# EAGLE design ioio-arduino-shield (EAGLE 6.1)
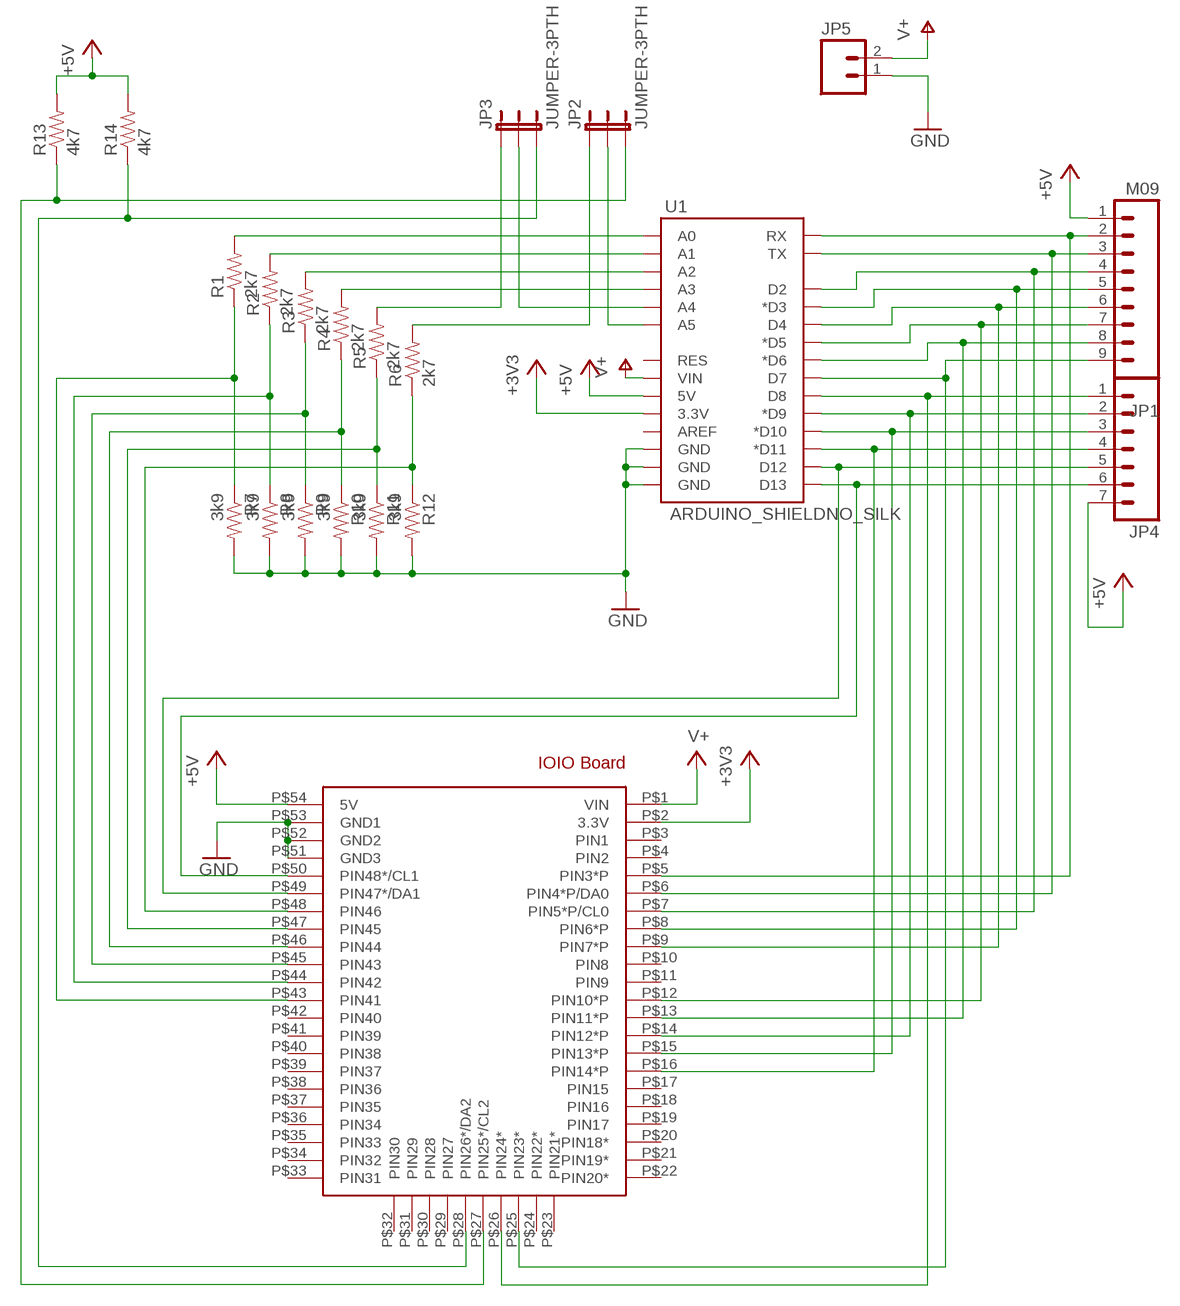
[diagram p0: schematic, sheet 1]

## Parts
JP1  M09  [1X09]
JP2  JUMPER-3PTH  [1X03]
JP3  JUMPER-3PTH  [1X03]
JP4  M07  [1X07]
JP5  M025MM  [SCREWTERMINAL-5MM-2]
R1  2k7  RESISTOR0805-RES  [0805]
R2  2k7  RESISTOR0805-RES  [0805]
R3  2k7  RESISTOR0805-RES  [0805]
R4  2k7  RESISTOR0805-RES  [0805]
R5  2k7  RESISTOR0805-RES  [0805]
R6  2k7  RESISTOR0805-RES  [0805]
R7  3k9  RESISTOR0805-RES  [0805]
R8  3k9  RESISTOR0805-RES  [0805]
R9  3k9  RESISTOR0805-RES  [0805]
R10  3k9  RESISTOR0805-RES  [0805]
R11  3k9  RESISTOR0805-RES  [0805]
R12  3k9  RESISTOR0805-RES  [0805]
R13  4k7  RESISTOR0805-RES  [0805]
R14  4k7  RESISTOR0805-RES  [0805]
U1  ARDUINO_SHIELDNO_SILK  [DUEMILANOVE_VIAS]
U$1  IOIO  [IOIO]

## Nets
+3V3: U1.3.3V U$1.P$2(3.3V)
+5V: JP1.1 JP4.7 R13.2 R14.2 U1.5V U$1.P$54(5V)
GND: JP5.1 R7.2 R8.2 R9.2 R10.2 R11.2 R12.2 U1.GND@0(GND) U1.GND@1(GND) U1.GND@2(GND) U$1.P$51(GND3) U$1.P$52(GND2) U$1.P$53(GND1)
N$1: R1.2 U1.A0
N$2: R2.2 U1.A1
N$3: R3.2 U1.A2
N$4: R4.2 U1.A3
N$5: JP3.1 R5.2
N$6: JP3.2 U1.A4
N$7: JP2.1 R6.2
N$8: JP2.2 U1.A5
N$9: R1.1 R7.1 U$1.P$43(PIN41)
N$10: JP1.2 U1.RX U$1.P$5(PIN3*P)
N$11: JP1.3 U1.TX U$1.P$6(PIN4*P/DA0)
N$13: JP1.4 U1.D2 U$1.P$7(PIN5*P/CL0)
N$14: JP1.5 U1.D3(*D3) U$1.P$8(PIN6*P)
N$15: U1.D4 U$1.P$9(PIN7*P)
N$16: JP1.7 U1.D5(*D5) U$1.P$12(PIN10*P)
N$17: JP1.8 U1.D6(*D6) U$1.P$13(PIN11*P)
N$18: JP4.1 U1.D8 U$1.P$26(PIN24*)
N$19: JP4.2 U1.D9(*D9) U$1.P$14(PIN12*P)
N$20: JP4.3 U1.D10(*D10) U$1.P$15(PIN13*P)
N$21: JP4.4 U1.D11(*D11) U$1.P$16(PIN14*P)
N$22: JP4.5 U1.D12 U$1.P$49(PIN47*/DA1)
N$23: JP4.6 U1.D13 U$1.P$50(PIN48*/CL1)
N$24: R2.1 R8.1 U$1.P$44(PIN42)
N$25: R3.1 R9.1 U$1.P$45(PIN43)
N$26: R4.1 R10.1 U$1.P$46(PIN44)
N$27: R5.1 R11.1 U$1.P$47(PIN45)
N$29: R6.1 R12.1 U$1.P$48(PIN46)
N$30: U1.D7 U$1.P$25(PIN23*)
N$31: JP2.3 R13.1 U$1.P$27(PIN25*/CL2)
N$32: JP3.3 R14.1 U$1.P$28(PIN26*/DA2)
V+: JP5.2 U1.VIN U$1.P$1(VIN)
Unconnected: JP1.6 JP1.9 U1.AREF U1.RES U$1.P$3(PIN1) U$1.P$4(PIN2) U$1.P$10(PIN8) U$1.P$11(PIN9) U$1.P$17(PIN15) U$1.P$18(PIN16) U$1.P$19(PIN17) U$1.P$20(PIN18*) U$1.P$21(PIN19*) U$1.P$22(PIN20*) U$1.P$23(PIN21*) U$1.P$24(PIN22*) U$1.P$29(PIN27) U$1.P$30(PIN28) U$1.P$31(PIN29) U$1.P$32(PIN30) U$1.P$33(PIN31) U$1.P$34(PIN32) U$1.P$35(PIN33) U$1.P$36(PIN34) U$1.P$37(PIN35) U$1.P$38(PIN36) U$1.P$39(PIN37) U$1.P$40(PIN38) U$1.P$41(PIN39) U$1.P$42(PIN40)

## Library data of the parts
JP1 = SparkFun-Connectors:M09: Header 9 Standard 9-pin 0.1" header. Use with straight break away headers (SKU : PRT-00116), right angle break away headers (PRT-00553), swiss pins (PRT-00743), machine pins (PRT-00117), and female headers (PRT-00115).
JP2 JP3 = SparkFun-Passives:JUMPER-3
JP4 = SparkFun-Connectors:M07: Header 7 Standard 7-pin 0.1" header. Use with straight break away headers (SKU : PRT-00116), right angle break away headers (PRT-00553), swiss pins (PRT-00743), machine pins (PRT-00117), and female headers (PRT-00115). NOTES ON THE VARIANTS LOCK and LOCK_LONGPADS... This footprint was designed to help hold the alignment of a through-hole component (i.e. 7-pin header) while soldering it into place. You may notice that each hole has been shifted either up or down by 0.005 of an inch from it's more standard position (which is usually a perfectly straight line). This slight alteration caused the pins (the squares in the middle) to touch the edges of the holes. Because they are alternating, it causes a "brace" to hold the header in place. 0.005 has proven to be the perfect amount of "off-center" position when using our standard breakaway headers. Although looks a little odd when you look at the bare footprint, once you have a header in there, the alteration is very hard to notice. Also, if you push a header all the way into place, it is covered up entirely on the bottom side. This idea of altering the position of holes to aid alignment will be further integrated into the Sparkfun Library for other footprints. It can help hold any component with 3 or more connection pins.
JP5 = SparkFun-Connectors:M02: Header 2 Standard 2-pin 0.1" header. Use with straight break away headers (SKU : PRT-00116), right angle break away headers (PRT-00553), swiss pins (PRT-00743), machine pins (PRT-00117), and female headers (PRT-00115). Molex polarized connector foot print use with SKU : PRT-08233 with associated crimp pins and housings.
R1-R14 = SparkFun-Passives:RESISTOR: Resistor Basic schematic elements and footprints for 0603, 1206, and PTH resistors.
U1 = SparkFun-Boards:ARDUINO_SHIELD: Arduino shield footprint
U$1 = SparkFun-IOIO:IOIO

## Board
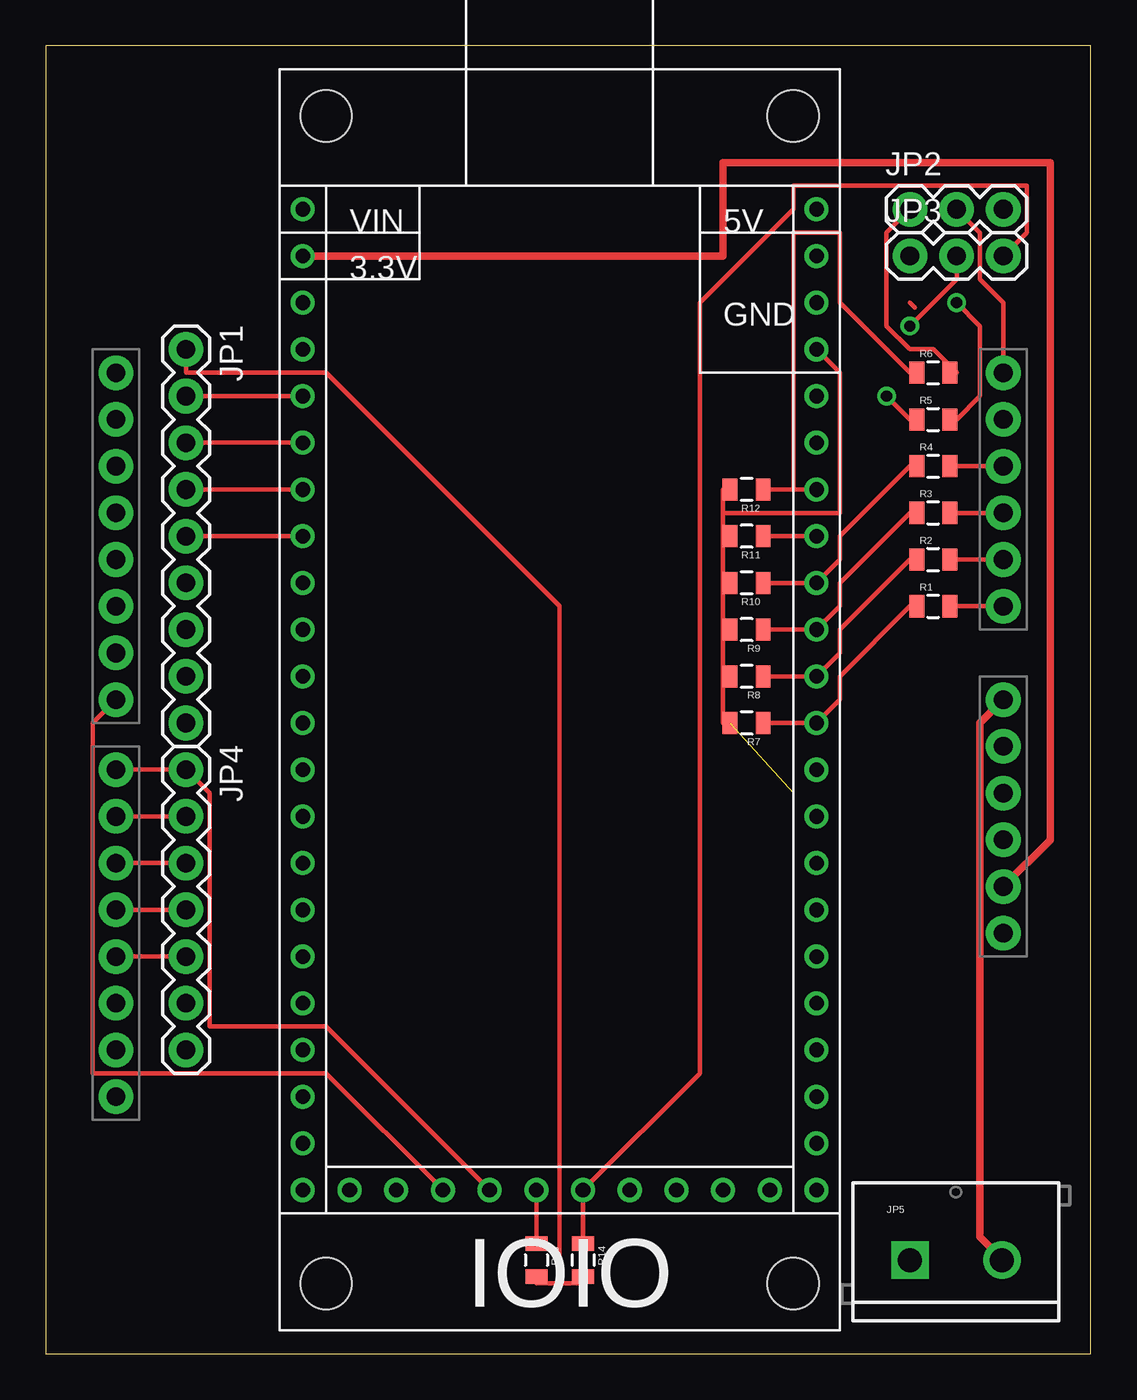
[diagram p1: board, top side]
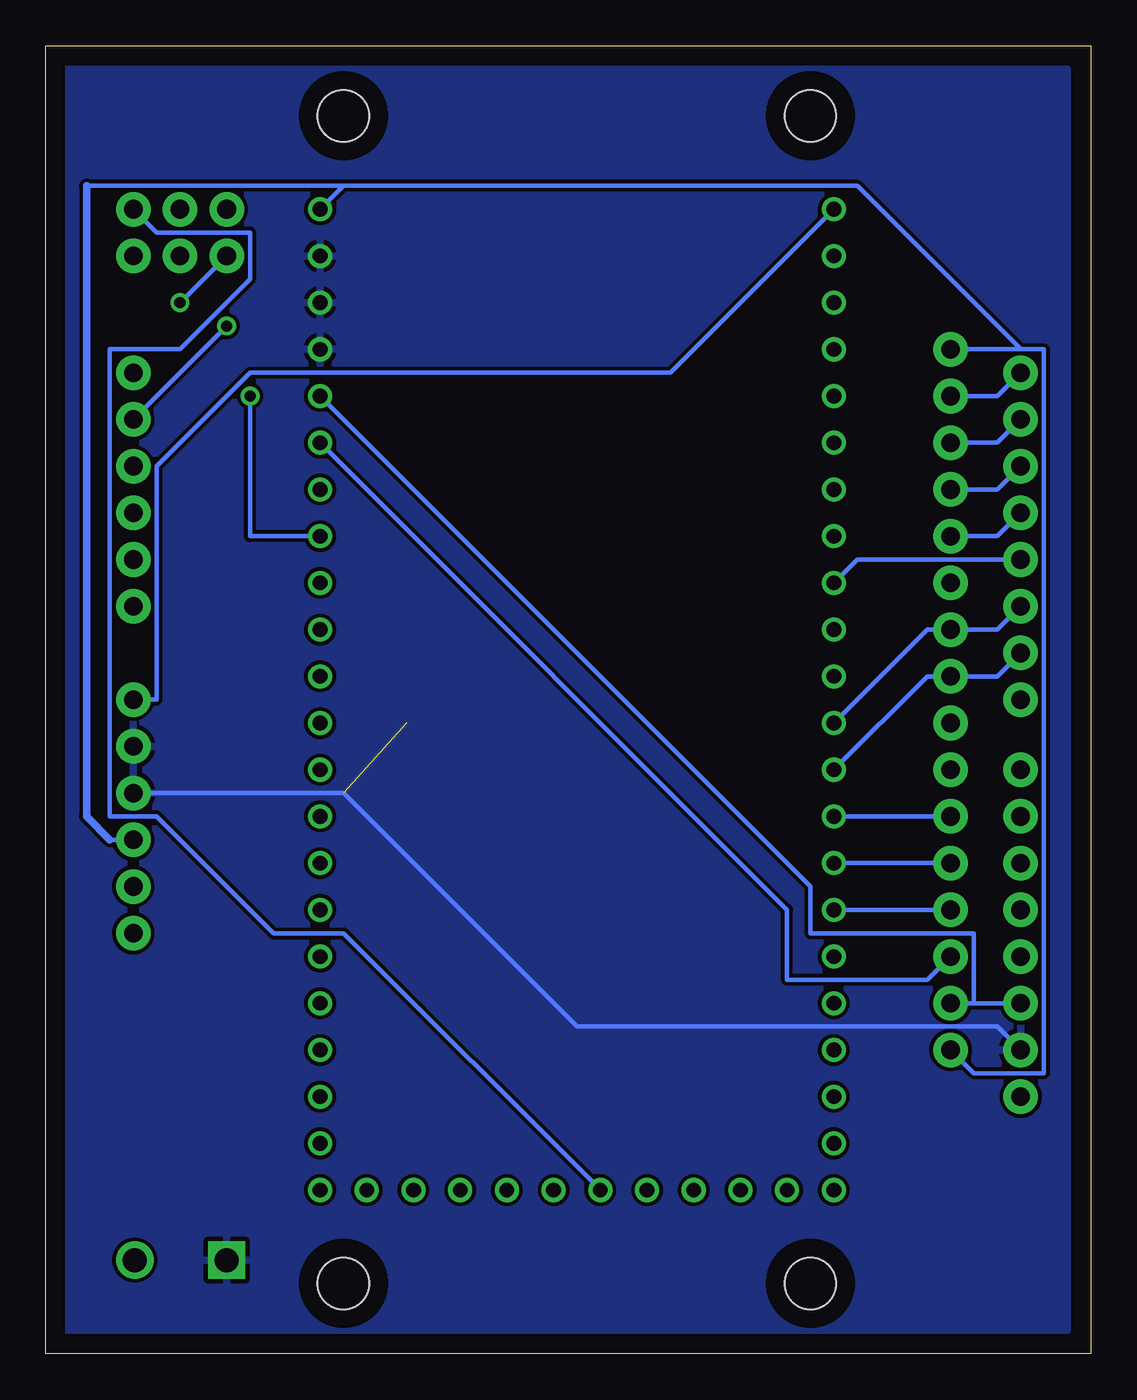
[diagram p2: board, bottom side, seen from below]

Size 56.82 x 71.11 mm. Coordinates in mm from the lower left corner, seen from the top.
Outline: 0,0 56.82,0 56.82,71.11 0,71.11 0,0
Copper layers (1*16): Top 0.035mm / dielectric 1.5mm / Bottom 0.035mm
Design rules: minimum track width 10mil, minimum drill 24mil, track to track 8mil, track to pad 8mil, pad to pad 8mil, via to via 8mil, smd to smd 8mil, copper to edge 40mil, drill to drill 8mil, minimum pad ring 10mil, minimum via ring 8mil, stop-mask expansion 4mil, vias tented up to drill 0mil, thermal gap 10mil

### Footprints (pad centres in the part's own frame; a part is rotated, then mirrored left to right if it is on the bottom)
1X09 = drill 1.016 pad 1.88: 1 0,0; 2 2.54,0; 3 5.08,0; 4 7.62,0; 5 10.16,0; 6 12.7,0; 7 15.24,0; 8 17.78,0; 9 20.32,0
1X03 = drill 1.016 pad 1.88: 1 0,0; 2 2.54,0; 3 5.08,0
1X07 = drill 1.016 pad 1.88: 1 0,0; 2 2.54,0; 3 5.08,0; 4 7.62,0; 5 10.16,0; 6 12.7,0; 7 15.24,0
SCREWTERMINAL-5MM-2 = drill 1.3 pad 2.032 square: 1 0,0 | drill 1.3 pad 2.032: 2 5,0
0805 = smd 0.8 x 1.2: 1 -0.9,0; 2 0.9,0
DUEMILANOVE_VIAS = drill 1.016 pad 1.88: 3.3V 50.8,13.97; 5V 50.8,16.51; A0 50.8,29.21; A1 50.8,31.75; A2 50.8,34.29; A3 50.8,36.83; A4 50.8,39.37; A5 50.8,41.91; AREF 2.54,2.54; D2 2.54,36.83; D3 2.54,34.29; D4 2.54,31.75; D5 2.54,29.21; D6 2.54,26.67; D7 2.54,24.13; D8 2.54,20.32; D9 2.54,17.78; D10 2.54,15.24; D11 2.54,12.7; D12 2.54,10.16; D13 2.54,7.62; GND@0 50.8,19.05; GND@1 50.8,21.59; GND@2 2.54,5.08; RES 50.8,11.43; RX 2.54,41.91; TX 2.54,39.37; VIN 50.8,24.13
IOIO = drill 0.8: P$1 -8.89,11.43; P$2 -8.89,8.89; P$3 -8.89,6.35; P$4 -8.89,3.81; P$5 -8.89,1.27; P$6 -8.89,-1.27; P$7 -8.89,-3.81; P$8 -8.89,-6.35; P$9 -8.89,-8.89; P$10 -8.89,-11.43; P$11 -8.89,-13.97; P$12 -8.89,-16.51; P$13 -8.89,-19.05; P$14 -8.89,-21.59; P$15 -8.89,-24.13; P$16 -8.89,-26.67; P$17 -8.89,-29.21; P$18 -8.89,-31.75; P$19 -8.89,-34.29; P$20 -8.89,-36.83; P$21 -8.89,-39.37; P$22 -8.89,-41.91; P$23 -6.35,-41.91; P$24 -3.81,-41.91; P$25 -1.27,-41.91; P$26 1.27,-41.91; P$27 3.81,-41.91; P$28 6.35,-41.91; P$29 8.89,-41.91; P$30 11.43,-41.91; P$31 13.97,-41.91; P$32 16.51,-41.91; P$33 19.05,-41.91; P$34 19.05,-39.37; P$35 19.05,-36.83; P$36 19.05,-34.29; P$37 19.05,-31.75; P$38 19.05,-29.21; P$39 19.05,-26.67; P$40 19.05,-24.13; P$41 19.05,-21.59; P$42 19.05,-19.05; P$43 19.05,-16.51; P$44 19.05,-13.97; P$45 19.05,-11.43; P$46 19.05,-8.89; P$47 19.05,-6.35; P$48 19.05,-3.81; P$49 19.05,-1.27; P$50 19.05,1.27; P$51 19.05,3.81; P$52 19.05,6.35; P$53 19.05,8.89; P$54 19.05,11.43 | hole 2.8: -7.62,16.51; 17.78,16.51; -7.62,-46.99; 17.78,-46.99

### Placement (x,y rotation side)
JP1  7.62,54.61 270 top
JP2  46.99,62.23 0 top
JP3  46.99,59.69 0 top
JP4  7.62,31.75 270 top
JP5  46.99,5.08 0 top
R1  48.26,40.64 0 top
R2  48.26,43.18 0 top
R3  48.26,45.72 0 top
R4  48.26,48.26 0 top
R5  48.26,50.8 0 top
R6  48.26,53.34 0 top
R7  38.1,34.29 180 top
R8  38.1,36.83 180 top
R9  38.1,39.37 180 top
R10  38.1,41.91 180 top
R11  38.1,44.45 180 top
R12  38.1,46.99 180 top
R13  26.67,5.08 270 top
R14  29.21,5.08 270 top
U1  1.27,11.43 0 top
U$1  22.86,50.8 0 top

### Tracks (layer width: path | path; a pad name or v marks a point on that pad's centre or on a via)
+3V3
  Top 0.406: U$1.P$2 36.83,59.69 36.83,62.23 36.83,64.77 54.61,64.77 54.61,27.94 U1.3.3V
+5V
  Top 0.254: JP1.1 7.62,53.34 15.24,53.34 27.94,40.64 27.94,3.81 | 27.94,3.81 29.21,3.81 R14.2 | 27.94,3.81 26.67,3.81 R13.2
  Bottom 0.254: JP4.7 6.35,15.24 2.54,15.24 2.54,54.61 3.81,54.61 | JP1.1 3.81,54.61 | 40.64,63.5 U$1.P$54 | 40.64,63.5 12.7,63.5 3.81,54.61 | 53.34,27.94 U1.5V | 40.64,63.5 54.61,63.5
  Bottom 0.406: 53.34,27.94 54.61,29.21 54.61,63.5
GND  (1 unrouted)
  Top 0.254: 36.83,45.72 36.83,46.99 R12.2 | 36.83,45.72 36.83,44.45 | 36.83,36.83 36.83,34.29 R7.2 | 36.83,41.91 36.83,39.37 | 36.83,39.37 36.83,36.83 | 36.83,36.83 R8.2 | 36.83,39.37 R9.2 | 36.83,41.91 36.83,44.45 | 36.83,44.45 R11.2 | 36.83,41.91 R10.2 | 36.83,45.72 43.18,45.72 43.18,53.34 U$1.P$51
  Bottom 0.254: U1.GND@2 5.08,17.78 27.94,17.78 40.64,30.48 U1.GND@0 | U$1.P$52
  pour Bottom: 1.27,69.85 1.27,1.27 55.88,1.27 55.88,69.85
N$1
  Top 0.254: U1.A0 R1.2
N$2
  Top 0.254: U1.A1 R2.2
N$3
  Top 0.254: U1.A2 R3.2
N$4
  Top 0.254: U1.A3 R4.2
N$5  (via drill 0.61)
  Top 0.254: v49.53,57.15 50.8,55.88 50.8,52.07 49.53,50.8 R5.2
  Bottom 0.254: JP3.1 v49.53,57.15
N$6  (via drill 0.61)
  Top 0.254: v46.99,55.88 49.53,58.42 JP3.2
  Bottom 0.254: v46.99,55.88 U1.A4
N$7
  Top 0.254: JP2.1 45.72,60.96 45.72,55.88 46.99,54.61 48.26,54.61 49.53,53.34 R6.2
N$8
  Top 0.254: U1.A5 52.07,57.15 50.8,58.42 50.8,60.96 JP2.2
N$9
  Top 0.254: R7.1 U$1.P$43 43.18,35.56 43.18,36.83 46.99,40.64 R1.1
N$10
  Top 0.254: JP1.2 U$1.P$5
  Bottom 0.254: U1.RX 5.08,52.07 JP1.2
N$11
  Top 0.254: JP1.3 U$1.P$6
  Bottom 0.254: U1.TX 5.08,49.53 JP1.3
N$13
  Top 0.254: JP1.4 U$1.P$7
  Bottom 0.254: U1.D2 5.08,46.99 JP1.4
N$14
  Top 0.254: JP1.5 U$1.P$8
  Bottom 0.254: U1.D3 5.08,44.45 JP1.5
N$15
  Bottom 0.254: U$1.P$9 12.7,43.18 U1.D4
N$16
  Bottom 0.254: U$1.P$12 8.89,39.37 JP1.7 5.08,39.37 U1.D5
N$17
  Bottom 0.254: U$1.P$13 8.89,36.83 JP1.8 5.08,36.83 U1.D6
N$18
  Top 0.254: U$1.P$26 15.24,17.78 8.89,17.78 8.89,30.48 JP4.1 U1.D8
N$19
  Top 0.254: JP4.2 U1.D9
  Bottom 0.254: JP4.2 U$1.P$14
N$20
  Top 0.254: JP4.3 U1.D10
  Bottom 0.254: JP4.3 U$1.P$15
N$21
  Top 0.254: JP4.4 U1.D11
  Bottom 0.254: JP4.4 U$1.P$16
N$22
  Top 0.254: JP4.5 U1.D12
  Bottom 0.254: U$1.P$49 16.51,24.13 16.51,20.32 8.89,20.32 JP4.5
N$23
  Bottom 0.254: 6.35,19.05 6.35,22.86 15.24,22.86 15.24,25.4 U$1.P$50 | JP4.6 6.35,19.05 | 6.35,19.05 U1.D13
N$24
  Top 0.254: R8.1 U$1.P$44 43.18,38.1 43.18,39.37 46.99,43.18 R2.1
N$25
  Top 0.254: R9.1 U$1.P$45 43.18,40.64 43.18,41.91 46.99,45.72 R3.1
N$26
  Top 0.254: R10.1 U$1.P$46 43.18,43.18 43.18,44.45 46.99,48.26 R4.1
N$27  (via drill 0.61)
  Top 0.254: U$1.P$47 R11.1 | v45.72,52.07 46.99,50.8 R5.1
  Bottom 0.254: v45.72,52.07 45.72,44.45 U$1.P$47
N$29
  Top 0.254: U$1.P$48 40.64,46.99 | 40.64,46.99 R12.1 | R6.1 46.99,53.34 43.18,57.15 43.18,60.96 40.64,60.96 40.64,46.99
N$30
  Top 0.254: U$1.P$25 15.24,15.24 2.54,15.24 2.54,34.29 U1.D7
N$31
  Top 0.254: U$1.P$27 R13.1
  Bottom 0.254: U$1.P$27 40.64,22.86 44.45,22.86 50.8,29.21 53.34,29.21 53.34,54.61 49.53,54.61 45.72,58.42 45.72,60.96 50.8,60.96 JP2.3
N$32
  Top 0.254: 29.21,5.08 R14.1 U$1.P$28 35.56,15.24 35.56,57.15 40.64,62.23 40.64,63.5 53.34,63.5 53.34,60.96 JP3.3
V+
  Top 0.254: 52.07,5.08 JP5.2
  Top 0.406: 52.07,5.08 50.8,6.35 50.8,34.29 U1.VIN
  Bottom 0.254: U$1.P$1 22.86,53.34 45.72,53.34 50.8,48.26 50.8,35.56 U1.VIN
VIN
  Top 0.254: 46.99,57.15 47.25,56.89